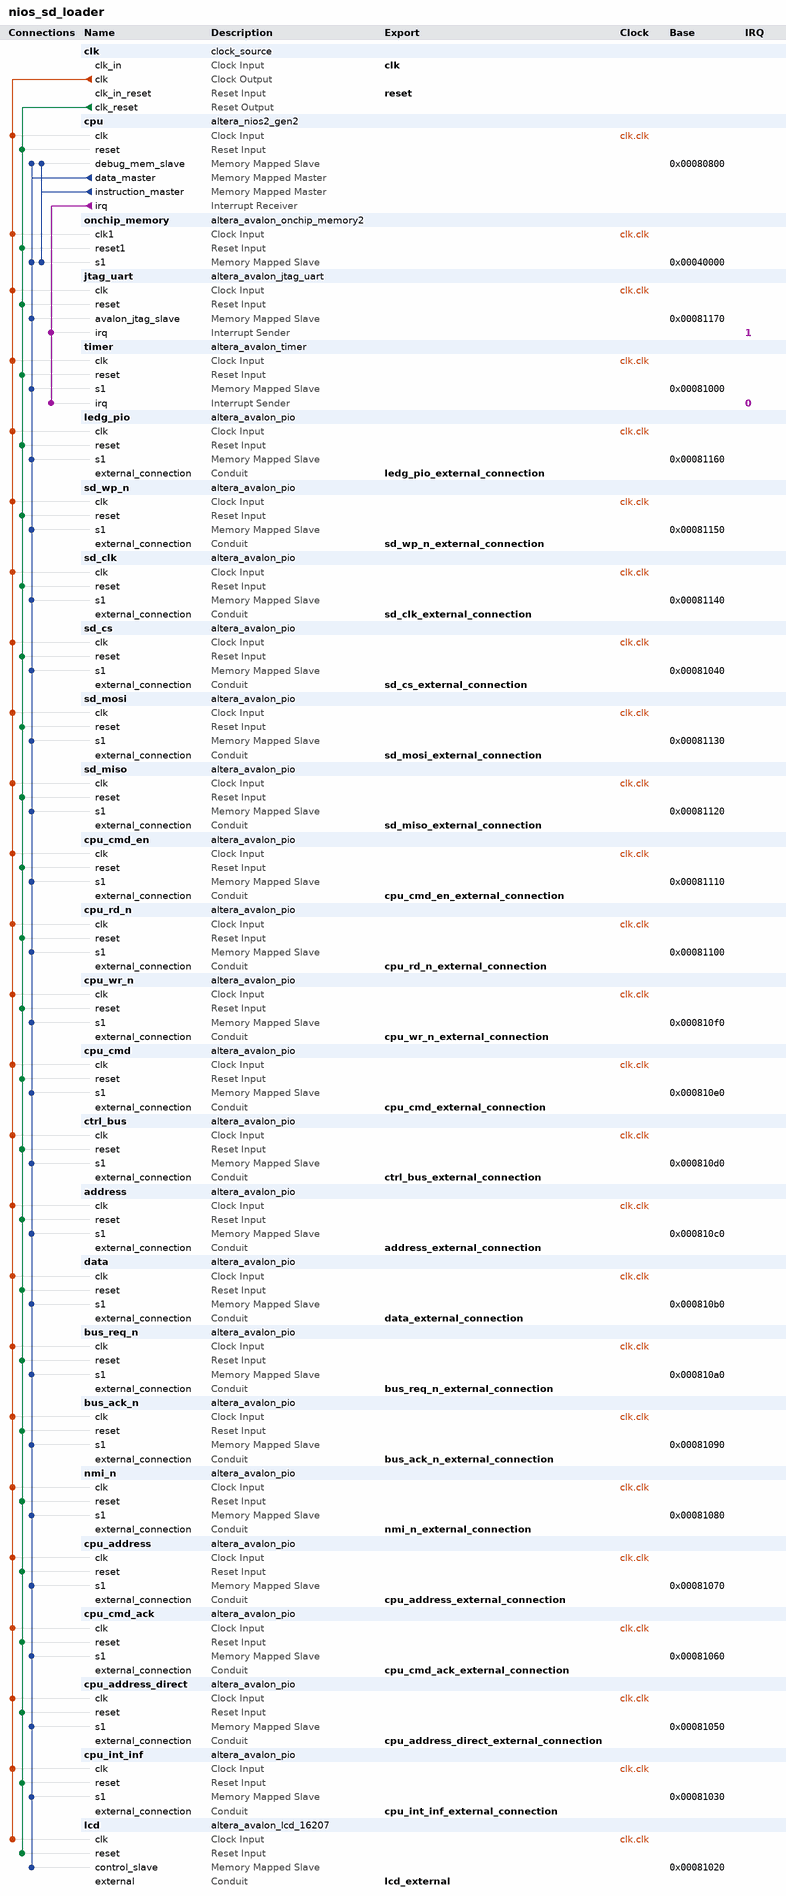
[diagram p0: system contents]
# Platform Designer (Qsys) system nios_sd_loader, Cyclone IV E EP4CE115F29C7
# Parameters at their usual value, and those the tool derives, are not listed.
package require -exact qsys 18.1
create_system nios_sd_loader
set_project_property DEVICE_FAMILY {Cyclone IV E}
set_project_property DEVICE EP4CE115F29C7

add_instance clk clock_source 18.1
set_instance_parameter_value clk clockFrequency 50000000

add_instance cpu altera_nios2_gen2 18.1
set_instance_parameter_value cpu dcache_size 2048
set_instance_parameter_value cpu exceptionSlave onchip_memory.s1
set_instance_parameter_value cpu icache_size 4096
set_instance_parameter_value cpu impl Tiny
set_instance_parameter_value cpu resetSlave onchip_memory.s1

add_instance onchip_memory altera_avalon_onchip_memory2 18.1
set_instance_parameter_value onchip_memory dataWidth 32
set_instance_parameter_value onchip_memory dualPort false
set_instance_parameter_value onchip_memory initMemContent true
set_instance_parameter_value onchip_memory initializationFileName onchip_mem.hex
set_instance_parameter_value onchip_memory memorySize 262144

add_instance jtag_uart altera_avalon_jtag_uart 18.1
set_instance_parameter_value jtag_uart simInteractiveOptions NO_INTERACTIVE_WINDOWS

add_instance timer altera_avalon_timer 18.1
set_instance_parameter_value timer period 1
set_instance_parameter_value timer periodUnits MSEC

add_instance ledg_pio altera_avalon_pio 18.1
set_instance_parameter_value ledg_pio direction Output
set_instance_parameter_value ledg_pio width 8

add_instance sd_wp_n altera_avalon_pio 18.1
set_instance_parameter_value sd_wp_n direction Input
set_instance_parameter_value sd_wp_n width 1

add_instance sd_clk altera_avalon_pio 18.1
set_instance_parameter_value sd_clk direction Output
set_instance_parameter_value sd_clk width 1

add_instance sd_cs altera_avalon_pio 18.1
set_instance_parameter_value sd_cs direction Output
set_instance_parameter_value sd_cs width 1

add_instance sd_mosi altera_avalon_pio 18.1
set_instance_parameter_value sd_mosi direction Output
set_instance_parameter_value sd_mosi width 1

add_instance sd_miso altera_avalon_pio 18.1
set_instance_parameter_value sd_miso direction Input
set_instance_parameter_value sd_miso width 1

add_instance cpu_cmd_en altera_avalon_pio 18.1
set_instance_parameter_value cpu_cmd_en direction Input
set_instance_parameter_value cpu_cmd_en width 1

add_instance cpu_rd_n altera_avalon_pio 18.1
set_instance_parameter_value cpu_rd_n direction Input
set_instance_parameter_value cpu_rd_n width 1

add_instance cpu_wr_n altera_avalon_pio 18.1
set_instance_parameter_value cpu_wr_n direction Input
set_instance_parameter_value cpu_wr_n width 1

add_instance cpu_cmd altera_avalon_pio 18.1
set_instance_parameter_value cpu_cmd direction Input
set_instance_parameter_value cpu_cmd width 8

add_instance ctrl_bus altera_avalon_pio 18.1
set_instance_parameter_value ctrl_bus direction Output
set_instance_parameter_value ctrl_bus resetValue 15
set_instance_parameter_value ctrl_bus width 4

add_instance address altera_avalon_pio 18.1
set_instance_parameter_value address direction Output
set_instance_parameter_value address width 16

add_instance data altera_avalon_pio 18.1
set_instance_parameter_value data direction Bidir
set_instance_parameter_value data width 8

add_instance bus_req_n altera_avalon_pio 18.1
set_instance_parameter_value bus_req_n direction Output
set_instance_parameter_value bus_req_n resetValue 1
set_instance_parameter_value bus_req_n width 1

add_instance bus_ack_n altera_avalon_pio 18.1
set_instance_parameter_value bus_ack_n direction Input
set_instance_parameter_value bus_ack_n width 1

add_instance nmi_n altera_avalon_pio 18.1
set_instance_parameter_value nmi_n direction Output
set_instance_parameter_value nmi_n resetValue 1
set_instance_parameter_value nmi_n width 1

add_instance cpu_address altera_avalon_pio 18.1
set_instance_parameter_value cpu_address direction Input
set_instance_parameter_value cpu_address width 16

add_instance cpu_cmd_ack altera_avalon_pio 18.1
set_instance_parameter_value cpu_cmd_ack direction Output
set_instance_parameter_value cpu_cmd_ack width 1

add_instance cpu_address_direct altera_avalon_pio 18.1
set_instance_parameter_value cpu_address_direct direction Input
set_instance_parameter_value cpu_address_direct width 16

add_instance cpu_int_inf altera_avalon_pio 18.1
set_instance_parameter_value cpu_int_inf direction Input
set_instance_parameter_value cpu_int_inf width 4

add_instance lcd altera_avalon_lcd_16207 18.1

# connections
add_connection clk.clk address.clk clock
add_connection clk.clk bus_ack_n.clk clock
add_connection clk.clk bus_req_n.clk clock
add_connection clk.clk cpu.clk clock
add_connection clk.clk cpu_address.clk clock
add_connection clk.clk cpu_address_direct.clk clock
add_connection clk.clk cpu_cmd.clk clock
add_connection clk.clk cpu_cmd_ack.clk clock
add_connection clk.clk cpu_cmd_en.clk clock
add_connection clk.clk cpu_int_inf.clk clock
add_connection clk.clk cpu_rd_n.clk clock
add_connection clk.clk cpu_wr_n.clk clock
add_connection clk.clk ctrl_bus.clk clock
add_connection clk.clk data.clk clock
add_connection clk.clk jtag_uart.clk clock
add_connection clk.clk lcd.clk clock
add_connection clk.clk ledg_pio.clk clock
add_connection clk.clk nmi_n.clk clock
add_connection clk.clk onchip_memory.clk1 clock
add_connection clk.clk sd_clk.clk clock
add_connection clk.clk sd_cs.clk clock
add_connection clk.clk sd_miso.clk clock
add_connection clk.clk sd_mosi.clk clock
add_connection clk.clk sd_wp_n.clk clock
add_connection clk.clk timer.clk clock
add_connection clk.clk_reset address.reset reset
add_connection clk.clk_reset bus_ack_n.reset reset
add_connection clk.clk_reset bus_req_n.reset reset
add_connection clk.clk_reset cpu.reset reset
add_connection clk.clk_reset cpu_address.reset reset
add_connection clk.clk_reset cpu_address_direct.reset reset
add_connection clk.clk_reset cpu_cmd.reset reset
add_connection clk.clk_reset cpu_cmd_ack.reset reset
add_connection clk.clk_reset cpu_cmd_en.reset reset
add_connection clk.clk_reset cpu_int_inf.reset reset
add_connection clk.clk_reset cpu_rd_n.reset reset
add_connection clk.clk_reset cpu_wr_n.reset reset
add_connection clk.clk_reset ctrl_bus.reset reset
add_connection clk.clk_reset data.reset reset
add_connection clk.clk_reset jtag_uart.reset reset
add_connection clk.clk_reset lcd.reset reset
add_connection clk.clk_reset ledg_pio.reset reset
add_connection clk.clk_reset nmi_n.reset reset
add_connection clk.clk_reset onchip_memory.reset1 reset
add_connection clk.clk_reset sd_clk.reset reset
add_connection clk.clk_reset sd_cs.reset reset
add_connection clk.clk_reset sd_miso.reset reset
add_connection clk.clk_reset sd_mosi.reset reset
add_connection clk.clk_reset sd_wp_n.reset reset
add_connection clk.clk_reset timer.reset reset
add_connection cpu.data_master address.s1 avalon
set_connection_parameter_value cpu.data_master/address.s1 baseAddress 0x000810c0
add_connection cpu.data_master bus_ack_n.s1 avalon
set_connection_parameter_value cpu.data_master/bus_ack_n.s1 baseAddress 0x00081090
add_connection cpu.data_master bus_req_n.s1 avalon
set_connection_parameter_value cpu.data_master/bus_req_n.s1 baseAddress 0x000810a0
add_connection cpu.data_master cpu.debug_mem_slave avalon
set_connection_parameter_value cpu.data_master/cpu.debug_mem_slave baseAddress 0x00080800
add_connection cpu.data_master cpu_address.s1 avalon
set_connection_parameter_value cpu.data_master/cpu_address.s1 baseAddress 0x00081070
add_connection cpu.data_master cpu_address_direct.s1 avalon
set_connection_parameter_value cpu.data_master/cpu_address_direct.s1 baseAddress 0x00081050
add_connection cpu.data_master cpu_cmd.s1 avalon
set_connection_parameter_value cpu.data_master/cpu_cmd.s1 baseAddress 0x000810e0
add_connection cpu.data_master cpu_cmd_ack.s1 avalon
set_connection_parameter_value cpu.data_master/cpu_cmd_ack.s1 baseAddress 0x00081060
add_connection cpu.data_master cpu_cmd_en.s1 avalon
set_connection_parameter_value cpu.data_master/cpu_cmd_en.s1 baseAddress 0x00081110
add_connection cpu.data_master cpu_int_inf.s1 avalon
set_connection_parameter_value cpu.data_master/cpu_int_inf.s1 baseAddress 0x00081030
add_connection cpu.data_master cpu_rd_n.s1 avalon
set_connection_parameter_value cpu.data_master/cpu_rd_n.s1 baseAddress 0x00081100
add_connection cpu.data_master cpu_wr_n.s1 avalon
set_connection_parameter_value cpu.data_master/cpu_wr_n.s1 baseAddress 0x000810f0
add_connection cpu.data_master ctrl_bus.s1 avalon
set_connection_parameter_value cpu.data_master/ctrl_bus.s1 baseAddress 0x000810d0
add_connection cpu.data_master data.s1 avalon
set_connection_parameter_value cpu.data_master/data.s1 baseAddress 0x000810b0
add_connection cpu.data_master jtag_uart.avalon_jtag_slave avalon
set_connection_parameter_value cpu.data_master/jtag_uart.avalon_jtag_slave baseAddress 0x00081170
add_connection cpu.data_master lcd.control_slave avalon
set_connection_parameter_value cpu.data_master/lcd.control_slave baseAddress 0x00081020
add_connection cpu.data_master ledg_pio.s1 avalon
set_connection_parameter_value cpu.data_master/ledg_pio.s1 baseAddress 0x00081160
add_connection cpu.data_master nmi_n.s1 avalon
set_connection_parameter_value cpu.data_master/nmi_n.s1 baseAddress 0x00081080
add_connection cpu.data_master onchip_memory.s1 avalon
set_connection_parameter_value cpu.data_master/onchip_memory.s1 baseAddress 0x00040000
add_connection cpu.data_master sd_clk.s1 avalon
set_connection_parameter_value cpu.data_master/sd_clk.s1 baseAddress 0x00081140
add_connection cpu.data_master sd_cs.s1 avalon
set_connection_parameter_value cpu.data_master/sd_cs.s1 baseAddress 0x00081040
add_connection cpu.data_master sd_miso.s1 avalon
set_connection_parameter_value cpu.data_master/sd_miso.s1 baseAddress 0x00081120
add_connection cpu.data_master sd_mosi.s1 avalon
set_connection_parameter_value cpu.data_master/sd_mosi.s1 baseAddress 0x00081130
add_connection cpu.data_master sd_wp_n.s1 avalon
set_connection_parameter_value cpu.data_master/sd_wp_n.s1 baseAddress 0x00081150
add_connection cpu.data_master timer.s1 avalon
set_connection_parameter_value cpu.data_master/timer.s1 baseAddress 0x00081000
add_connection cpu.instruction_master cpu.debug_mem_slave avalon
set_connection_parameter_value cpu.instruction_master/cpu.debug_mem_slave baseAddress 0x00080800
add_connection cpu.instruction_master onchip_memory.s1 avalon
set_connection_parameter_value cpu.instruction_master/onchip_memory.s1 baseAddress 0x00040000
add_connection cpu.irq jtag_uart.irq interrupt
set_connection_parameter_value cpu.irq/jtag_uart.irq irqNumber 1
add_connection cpu.irq timer.irq interrupt
set_connection_parameter_value cpu.irq/timer.irq irqNumber 0

# exported interfaces
add_interface address_external_connection conduit end
set_interface_property address_external_connection EXPORT_OF address.external_connection
add_interface bus_ack_n_external_connection conduit end
set_interface_property bus_ack_n_external_connection EXPORT_OF bus_ack_n.external_connection
add_interface bus_req_n_external_connection conduit end
set_interface_property bus_req_n_external_connection EXPORT_OF bus_req_n.external_connection
add_interface clk clock sink
set_interface_property clk EXPORT_OF clk.clk_in
add_interface cpu_address_direct_external_connection conduit end
set_interface_property cpu_address_direct_external_connection EXPORT_OF cpu_address_direct.external_connection
add_interface cpu_address_external_connection conduit end
set_interface_property cpu_address_external_connection EXPORT_OF cpu_address.external_connection
add_interface cpu_cmd_ack_external_connection conduit end
set_interface_property cpu_cmd_ack_external_connection EXPORT_OF cpu_cmd_ack.external_connection
add_interface cpu_cmd_en_external_connection conduit end
set_interface_property cpu_cmd_en_external_connection EXPORT_OF cpu_cmd_en.external_connection
add_interface cpu_cmd_external_connection conduit end
set_interface_property cpu_cmd_external_connection EXPORT_OF cpu_cmd.external_connection
add_interface cpu_int_inf_external_connection conduit end
set_interface_property cpu_int_inf_external_connection EXPORT_OF cpu_int_inf.external_connection
add_interface cpu_rd_n_external_connection conduit end
set_interface_property cpu_rd_n_external_connection EXPORT_OF cpu_rd_n.external_connection
add_interface cpu_wr_n_external_connection conduit end
set_interface_property cpu_wr_n_external_connection EXPORT_OF cpu_wr_n.external_connection
add_interface ctrl_bus_external_connection conduit end
set_interface_property ctrl_bus_external_connection EXPORT_OF ctrl_bus.external_connection
add_interface data_external_connection conduit end
set_interface_property data_external_connection EXPORT_OF data.external_connection
add_interface lcd_external conduit end
set_interface_property lcd_external EXPORT_OF lcd.external
add_interface ledg_pio_external_connection conduit end
set_interface_property ledg_pio_external_connection EXPORT_OF ledg_pio.external_connection
add_interface nmi_n_external_connection conduit end
set_interface_property nmi_n_external_connection EXPORT_OF nmi_n.external_connection
add_interface reset reset sink
set_interface_property reset EXPORT_OF clk.clk_in_reset
add_interface sd_clk_external_connection conduit end
set_interface_property sd_clk_external_connection EXPORT_OF sd_clk.external_connection
add_interface sd_cs_external_connection conduit end
set_interface_property sd_cs_external_connection EXPORT_OF sd_cs.external_connection
add_interface sd_miso_external_connection conduit end
set_interface_property sd_miso_external_connection EXPORT_OF sd_miso.external_connection
add_interface sd_mosi_external_connection conduit end
set_interface_property sd_mosi_external_connection EXPORT_OF sd_mosi.external_connection
add_interface sd_wp_n_external_connection conduit end
set_interface_property sd_wp_n_external_connection EXPORT_OF sd_wp_n.external_connection

set_interconnect_requirement {$system} qsys_mm.clockCrossingAdapter HANDSHAKE
set_interconnect_requirement {$system} qsys_mm.enableEccProtection FALSE
set_interconnect_requirement {$system} qsys_mm.insertDefaultSlave FALSE
set_interconnect_requirement {$system} qsys_mm.maxAdditionalLatency 1

save_system nios_sd_loader.qsys
